# EAGLE design rw-linear-20mm-mk-1.0.0 (EAGLE 7.5.0)
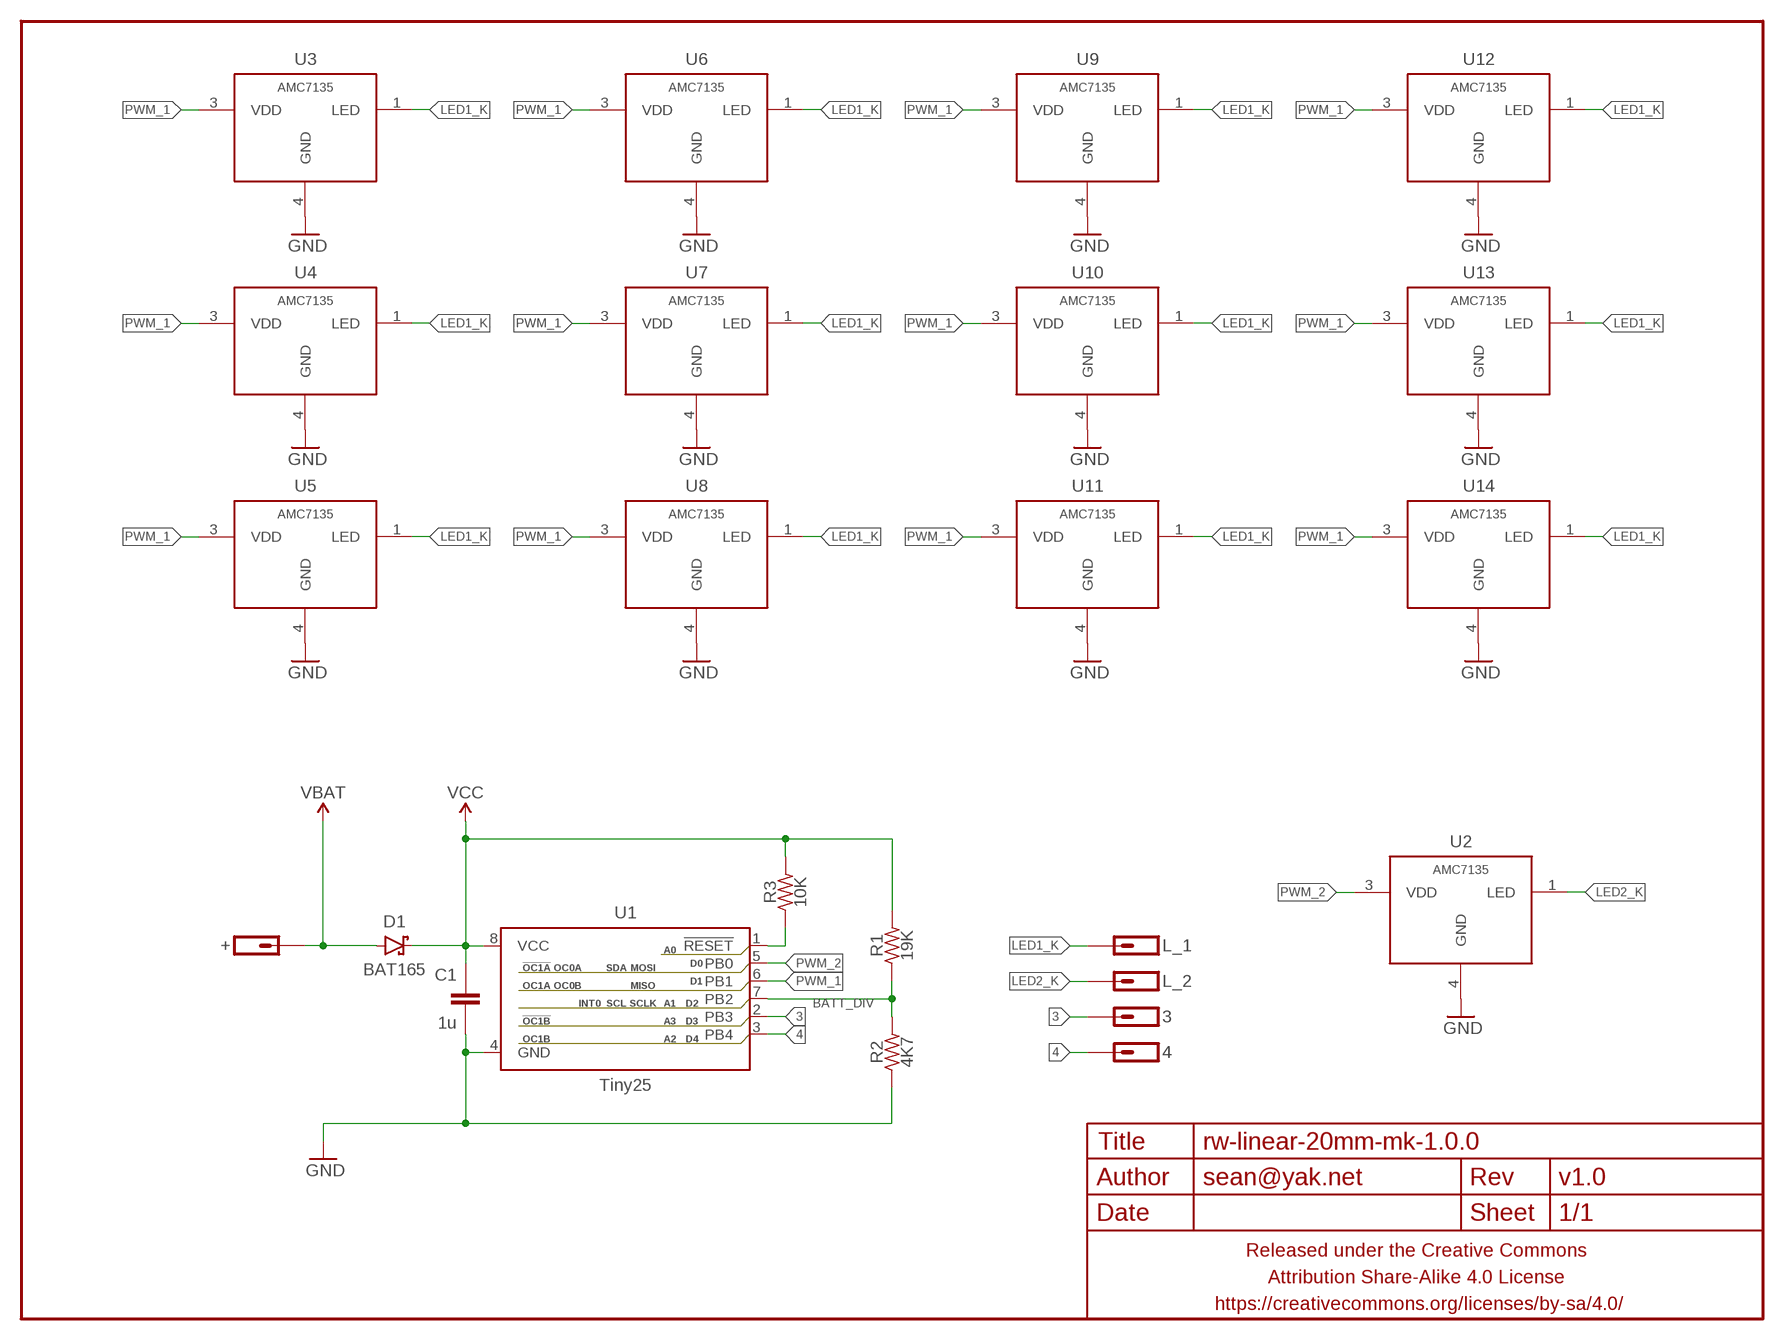
[diagram p0: schematic, sheet 1]

## Parts
3  M01SMD-1MM-DIA-NS  [1X01-SMD-1MM-DIA-NS]
4  M01SMD-1MM-DIA-NS  [1X01-SMD-1MM-DIA-NS]
+  M01PTH-1MM-CIR-NS  [1X01-1MM-CIR-NS]
C1  1u  CAPACITOR-CERAMICC0603-TIGHTER  [C0603-TIGHTER]
D1  BAT165  DIODE-SCHOTTKYSMA  [SMA-DIODE-SCHOTTKY]
FRAME1  FRAME-LETTERNO_PACKAGE  [DUMMY]
L_1  M011X01-0.9MM-CIR  [1X01-0.9MM-CIR]
L_2  M01PTH-0.8MM-CIR  [1X01-0.8MM-CIR]
R1  19K  RESISTORR0603-TIGHTER  [R0603-TIGHTER]
R2  4K7  RESISTORR0603-TIGHTER  [R0603-TIGHTER]
R3  10K  RESISTORR0603-TIGHTER  [R0603-TIGHTER]
U1  Tiny25  ATTINY13SOIC-NARROWPADS  [SO08-NARROWER]
U2  AMC7135  AMC7135SOT-89-NOTHERM-ROUNDED-LESS  [SOT89-NOTHERM-ROUNDED-LESS]
U3  AMC7135  AMC7135SOT-89-NOTHERM-ROUNDED-LESS  [SOT89-NOTHERM-ROUNDED-LESS]
U4  AMC7135  AMC7135SOT-89-NOTHERM-ROUNDED-LESS  [SOT89-NOTHERM-ROUNDED-LESS]
U5  AMC7135  AMC7135SOT-89-NOTHERM-ROUNDED-LESS  [SOT89-NOTHERM-ROUNDED-LESS]
U6  AMC7135  AMC7135SOT-89-NOTHERM-ROUNDED-LESS  [SOT89-NOTHERM-ROUNDED-LESS]
U7  AMC7135  AMC7135SOT-89-NOTHERM-ROUNDED-LESS  [SOT89-NOTHERM-ROUNDED-LESS]
U8  AMC7135  AMC7135SOT-89-NOTHERM-ROUNDED-LESS  [SOT89-NOTHERM-ROUNDED-LESS]
U9  AMC7135  AMC7135SOT-89-NOTHERM-ROUNDED-LESS  [SOT89-NOTHERM-ROUNDED-LESS]
U10  AMC7135  AMC7135SOT-89-NOTHERM-ROUNDED-LESS  [SOT89-NOTHERM-ROUNDED-LESS]
U11  AMC7135  AMC7135SOT-89-NOTHERM-ROUNDED-LESS  [SOT89-NOTHERM-ROUNDED-LESS]
U12  AMC7135  AMC7135SOT-89-NOTHERM-ROUNDED-LESS  [SOT89-NOTHERM-ROUNDED-LESS]
U13  AMC7135  AMC7135SOT-89-NOTHERM-ROUNDED-LESS  [SOT89-NOTHERM-ROUNDED-LESS]
U14  AMC7135  AMC7135SOT-89-NOTHERM-ROUNDED-LESS  [SOT89-NOTHERM-ROUNDED-LESS]

## Nets
3: 3.P$1 U1.2(PB3)
4: 4.P$1 U1.3(PB4)
BATT_DIV: R1.1 R2.2 U1.7(PB2)
GND: C1.2 R2.1 U1.4(GND) U2.4(GND) U3.4(GND) U4.4(GND) U5.4(GND) U6.4(GND) U7.4(GND) U8.4(GND) U9.4(GND) U10.4(GND) U11.4(GND) U12.4(GND) U13.4(GND) U14.4(GND)
LED1_K: L_1.P$1 U3.1(LED) U4.1(LED) U5.1(LED) U6.1(LED) U7.1(LED) U8.1(LED) U9.1(LED) U10.1(LED) U11.1(LED) U12.1(LED) U13.1(LED) U14.1(LED)
LED2_K: L_2.1 U2.1(LED)
N$1: R3.1 U1.1(!RESET)
PWM_1: U1.6(PB1) U3.3(VDD) U4.3(VDD) U5.3(VDD) U6.3(VDD) U7.3(VDD) U8.3(VDD) U9.3(VDD) U10.3(VDD) U11.3(VDD) U12.3(VDD) U13.3(VDD) U14.3(VDD)
PWM_2: U1.5(PB0) U2.3(VDD)
VBAT: +.1 D1.A
VCC: C1.1 D1.C R1.2 R3.2 U1.8(VCC)

## Library data of the parts
3 4 + L_1 L_2 = a_parts:M01: Header 1 Standard 1-pin 0.1" header. Use with straight break away headers (SKU : PRT-00116), right angle break away headers (PRT-00553), swiss pins (PRT-00743), machine pins (PRT-00117), and female headers (PRT-00115).
C1 = a_parts:CAPACITOR-CERAMIC: CAPACITOR, European symbol
D1 = a_parts:DIODE-SCHOTTKY: Schottky diodes in SFE's production catalog BAT20J 1A 23V 0.62Vf RB751 120mA 40V 0.37Vf PMEG4005EJ 0.5A 40V 0.42Vf MBRA140 1A 40V 0.5Vf B340A 3A 40V SMA
FRAME1 = a_parts:FRAME-LETTER: Schematic Frame Standard 8.5x11 US Letter frame; DESIGNER: sean@yak.net; VERSION: v1.0
R1-R3 = a_parts:RESISTOR: RESISTOR, American symbol
U1 = a_parts:ATTINY13: Atmel 8-pin 1kB flash uC
U2-U14 = a_parts:AMC7135

## Board
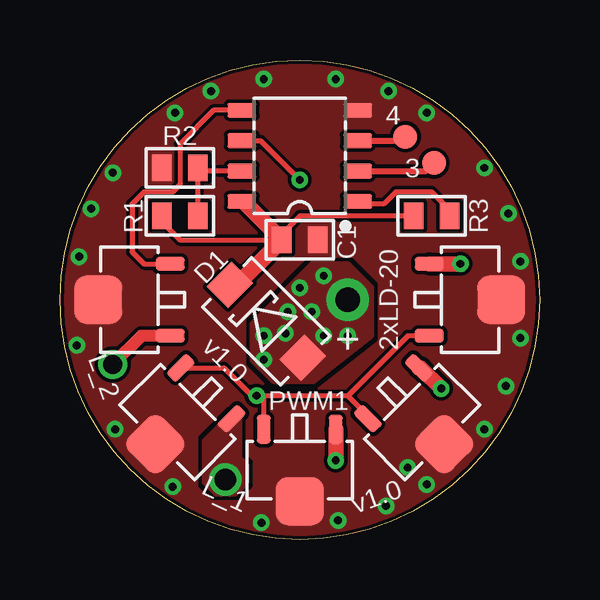
[diagram p1: board, top side]
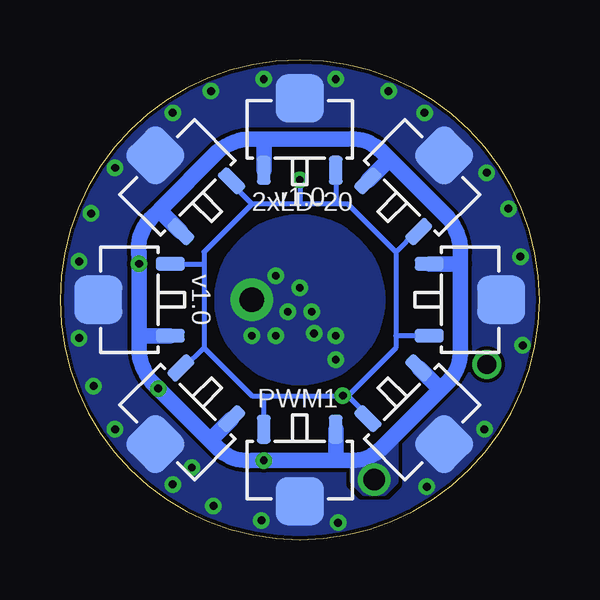
[diagram p2: board, bottom side, seen from below]

Size 20 x 20 mm. Coordinates in mm from the lower left corner, seen from the top.
Outline: 0,10 arc-180 20,10 arc-180 0,10
Copper layers (1*16): Top 0.0356mm / dielectric 1.5011mm / Bottom 0.0356mm
Design rules "LaenPCBOrder2": minimum track width 6mil, minimum drill 13mil, track to track 6mil, track to pad 6mil, pad to pad 6mil, via to via 6mil, smd to smd 6mil, copper to edge 6mil, drill to drill 6mil, minimum pad ring 7mil, minimum via ring 7mil, stop-mask expansion 3mil, vias tented up to drill 20mil, thermal gap 10mil

### Footprints (pad centres in the part's own frame; a part is rotated, then mirrored left to right if it is on the bottom)
1X01-SMD-1MM-DIA-NS = smd 1 x 1: P$1 0,0
1X01-1MM-CIR-NS = drill 1.016 pad 1.778: 1 0,0
C0603-TIGHTER = smd 0.8 x 1.1: 1 -0.75,0; 2 0.75,0
SMA-DIODE-SCHOTTKY = smd 1.27 x 1.47: A -2.15,0; C 2.15,0
1X01-0.9MM-CIR = drill 0.9 pad 1.3: P$1 0,0
1X01-0.8MM-CIR = drill 0.8: 1 0,0
R0603-TIGHTER = smd 0.8 x 1.1: 1 -0.75,0; 2 0.75,0
SO08-NARROWER = smd 0.6 x 1.2: 1 -1.905,-2.416; 2 -0.635,-2.416; 3 0.635,-2.416; 4 1.905,-2.416; 5 1.905,2.416; 6 0.635,2.416; 7 -0.635,2.416; 8 -1.905,2.416
SOT89-NOTHERM-ROUNDED-LESS = smd 0.58 x 1.2: 1 -1.5,-1.7; 3 1.5,-1.7 | smd 2 x 2: 4 0,1.3

### Placement (x,y rotation side)
3  15.6,15.7 0 top
4  14.4,16.8 0 top
+  12,10 90 top
C1  10,12.5 0 top
D1  8.6,9.1 135 top
FRAME1  0,0 0 top
L_1  6.9,2.5 270 top
L_2  2.2,7.3 180 top
R1  5,13.5 180 top
R2  5,15.5 0 top
R3  15.5,13.5 180 top
U1  10,16 90 top
U2  2.9,10 90 top
U3  4.9,4.9 135 top
U4  10,2.9 180 top
U5  15.1,4.9 225 top
U6  17.1,10 270 top
U7  10,17.1 0 bottom
U8  15.1,15.1 45 bottom
U9  17.1,10 90 bottom
U10  15.1,4.9 135 bottom
U11  10,2.9 180 bottom
U12  4.9,4.9 225 bottom
U13  2.9,10 270 bottom
U14  4.9,15.1 315 bottom

### Tracks (layer width: path | path; a pad name or v marks a point on that pad's centre or on a via)
3
  Top 0.25: U1.2 15.27,15.37 3.P$1
4
  Top 0.25: U1.3 14.23,16.64 4.P$1
BATT_DIV
  Top 0.2: R1.1 R2.2 5.88,15.37 U1.7
GND  (via drill 0.33)
  other vias: 14.5,3 8.5,19.2 11.5,19.2 13.7,18.7 6.3,18.7 4.8,17.8 15.3,17.8 1.3,13.8 2.2,15.3 0.8,11.8 0.7,8.1 2.3,4.6 4.7,2.2 8.4,0.7 11.6,0.8 15.3,2.3 13.6,1.4 17.7,15.5 19.2,11.6 18.7,13.6 19.2,8.4 17.7,4.6 18.6,6.4
  pour Top (isolate 0.152, rank 6, no thermals): 0,10 arc90 10,0 arc90 20,10 arc90 10,20 arc90
  pour Bottom (isolate 0.152, rank 6, no thermals): 20,10 arc-90 10,0 arc-90 0,10 arc-90 10,20 arc-90
LED1_K  (via drill 0.33)
  Top 0.65: U4.1 v11.5,3.3 | U5.1 15.04,7.16 v15.9,6.3 | U6.1 v16.7,11.5
  Bottom 0.65: 6.25,15.85 3.8,13.4 arc39 3.3,12 3.3,11.5 | 6.25,15.85 6.6,16.2 arc-51 8,16.7 11.5,16.7 | 11.5,16.7 12,16.7 arc-39 13.4,16.2 15.85,13.75 | 15.85,13.75 16.2,13.4 arc-55 16.7,11.8 | 13.7,4.1 13.4,3.8 arc-51 12,3.3 v11.5,3.3 8.5,3.3 | 13.7,4.1 v15.9,6.3 16.2,6.6 arc39 16.7,8 16.7,8.5 | 4.15,6.25 3.8,6.6 arc-48 3.3,7.9 | 4.15,6.25 6.6,3.8 arc51 8,3.3 8.5,3.3 | 3.3,8 3.3,11.5 | 16.7,8.5 v16.7,11.5 16.7,11.8 | 16.7,11.8 16.7,12 | U13.1 3.3,11.5 | U14.1 6.27,15.85 6.25,15.85 | U7.1 11.5,16.7 | U8.1 15.85,13.73 15.85,13.75 | U9.1 16.7,8.5 | U10.1 13.7,4.18 13.7,4.1 | U12.1 4.15,6.27 4.15,6.25 | U11.1 8.5,3.3
  pour Bottom (isolate 0.152, rank 2, no thermals): 6,4.5 6,2.4 6.5,1.9 7.3,1.9 7.8,2.4 7.8,3.5 7,3.5
  pour Top (isolate 0.152, rank 2, no thermals): 7.2,5.3 6,4.1 6,2.4 6.5,1.9 7.3,1.9 7.8,2.4 7.8,3.1 7.5,3.4 7.5,5
LED2_K
  Top 0.5: U2.1 3.4,8.5 L_2.1
N$1
  Top 0.2: R3.1 16.25,13.75 15.5,14.5 14,14.5 13.5,14 12.51,14 U1.1
PWM_1  (via drill 0.33)
  Top 0.2: U5.3 12.84,5.16 12,6 | U4.3 8.5,6 | 8.5,6 v8.2,6 8,6 6.84,7.16 U3.3 | 12,6 8.5,6 | U6.3 14.5,8.5 12,6 | U1.6 8.37,16.64 v10,15
  Bottom 0.2: U12.3 7.16,5.16 8,6 | U14.3 5.16,12.84 6,12 | 6,12 6,8.5 | U13.3 6,8.5 | 6,12 8,14 8.5,14 | 8.5,14 10,14 | v10,15 10,14 | 14,11.5 14,12 12,14 | 14,11.5 14,8 | 11.5,6 12,6 14,8 | 11.5,6 v8.2,6 8,6 | 10,14 12,14 | 6,8.5 6,8 8,6 | U9.3 14,11.5 | U8.3 12.84,14.84 12,14 | U11.3 11.5,6 | 14,8 14.84,7.16 U10.3 | U7.3 8.5,14
PWM_2
  Top 0.2: U1.5 6.41,17.91 5,16.5 5,14.8 4.7,14.5 3.5,14.5 3,14 3,12 3.5,11.5 U2.3
VBAT  (via drill 0.33)
  other vias: 9.5,9.5 10.5,9.5 10,10.5 11,8.5 8.5,8.5 9.4,8.6 12,8.5 11,11 8.5,7.5
  pour Bottom (isolate 0.152, no thermals): 6.5,10 arc-180 13.5,10 arc-180
  pour Top (isolate 0.152, rank 2, no thermals): 8,7.5 8.9,6.6 10.6,6.6 13,8.5 13,10.5 12,11.5 10.5,11.5 8,9
VCC
  Top 0.2: R1.2 4.25,13.25 5,12.5 C1.1 9.25,12.75 10,13.5 R3.2
  Top 0.65: D1.C 7.27,10.52 C1.1 7.66,14.1 U1.8

### Text on the board
tPlace: 2xLD-20 | PWM1
bPlace: 2xLD-20 | PWM1